# EasyEDA Pro project ProProject_FOC PRO_2025-05-28.epro, schematic Schematic1

## Sheets
1 P1: Create Date: 2024-11-13; Page Name: P1; Project Name: FOC PRO; Schematic Name: Schematic1; Update Date: 2024-12-27; Company: 嘉立创EDA; Page Size: A4; Version: V1.0
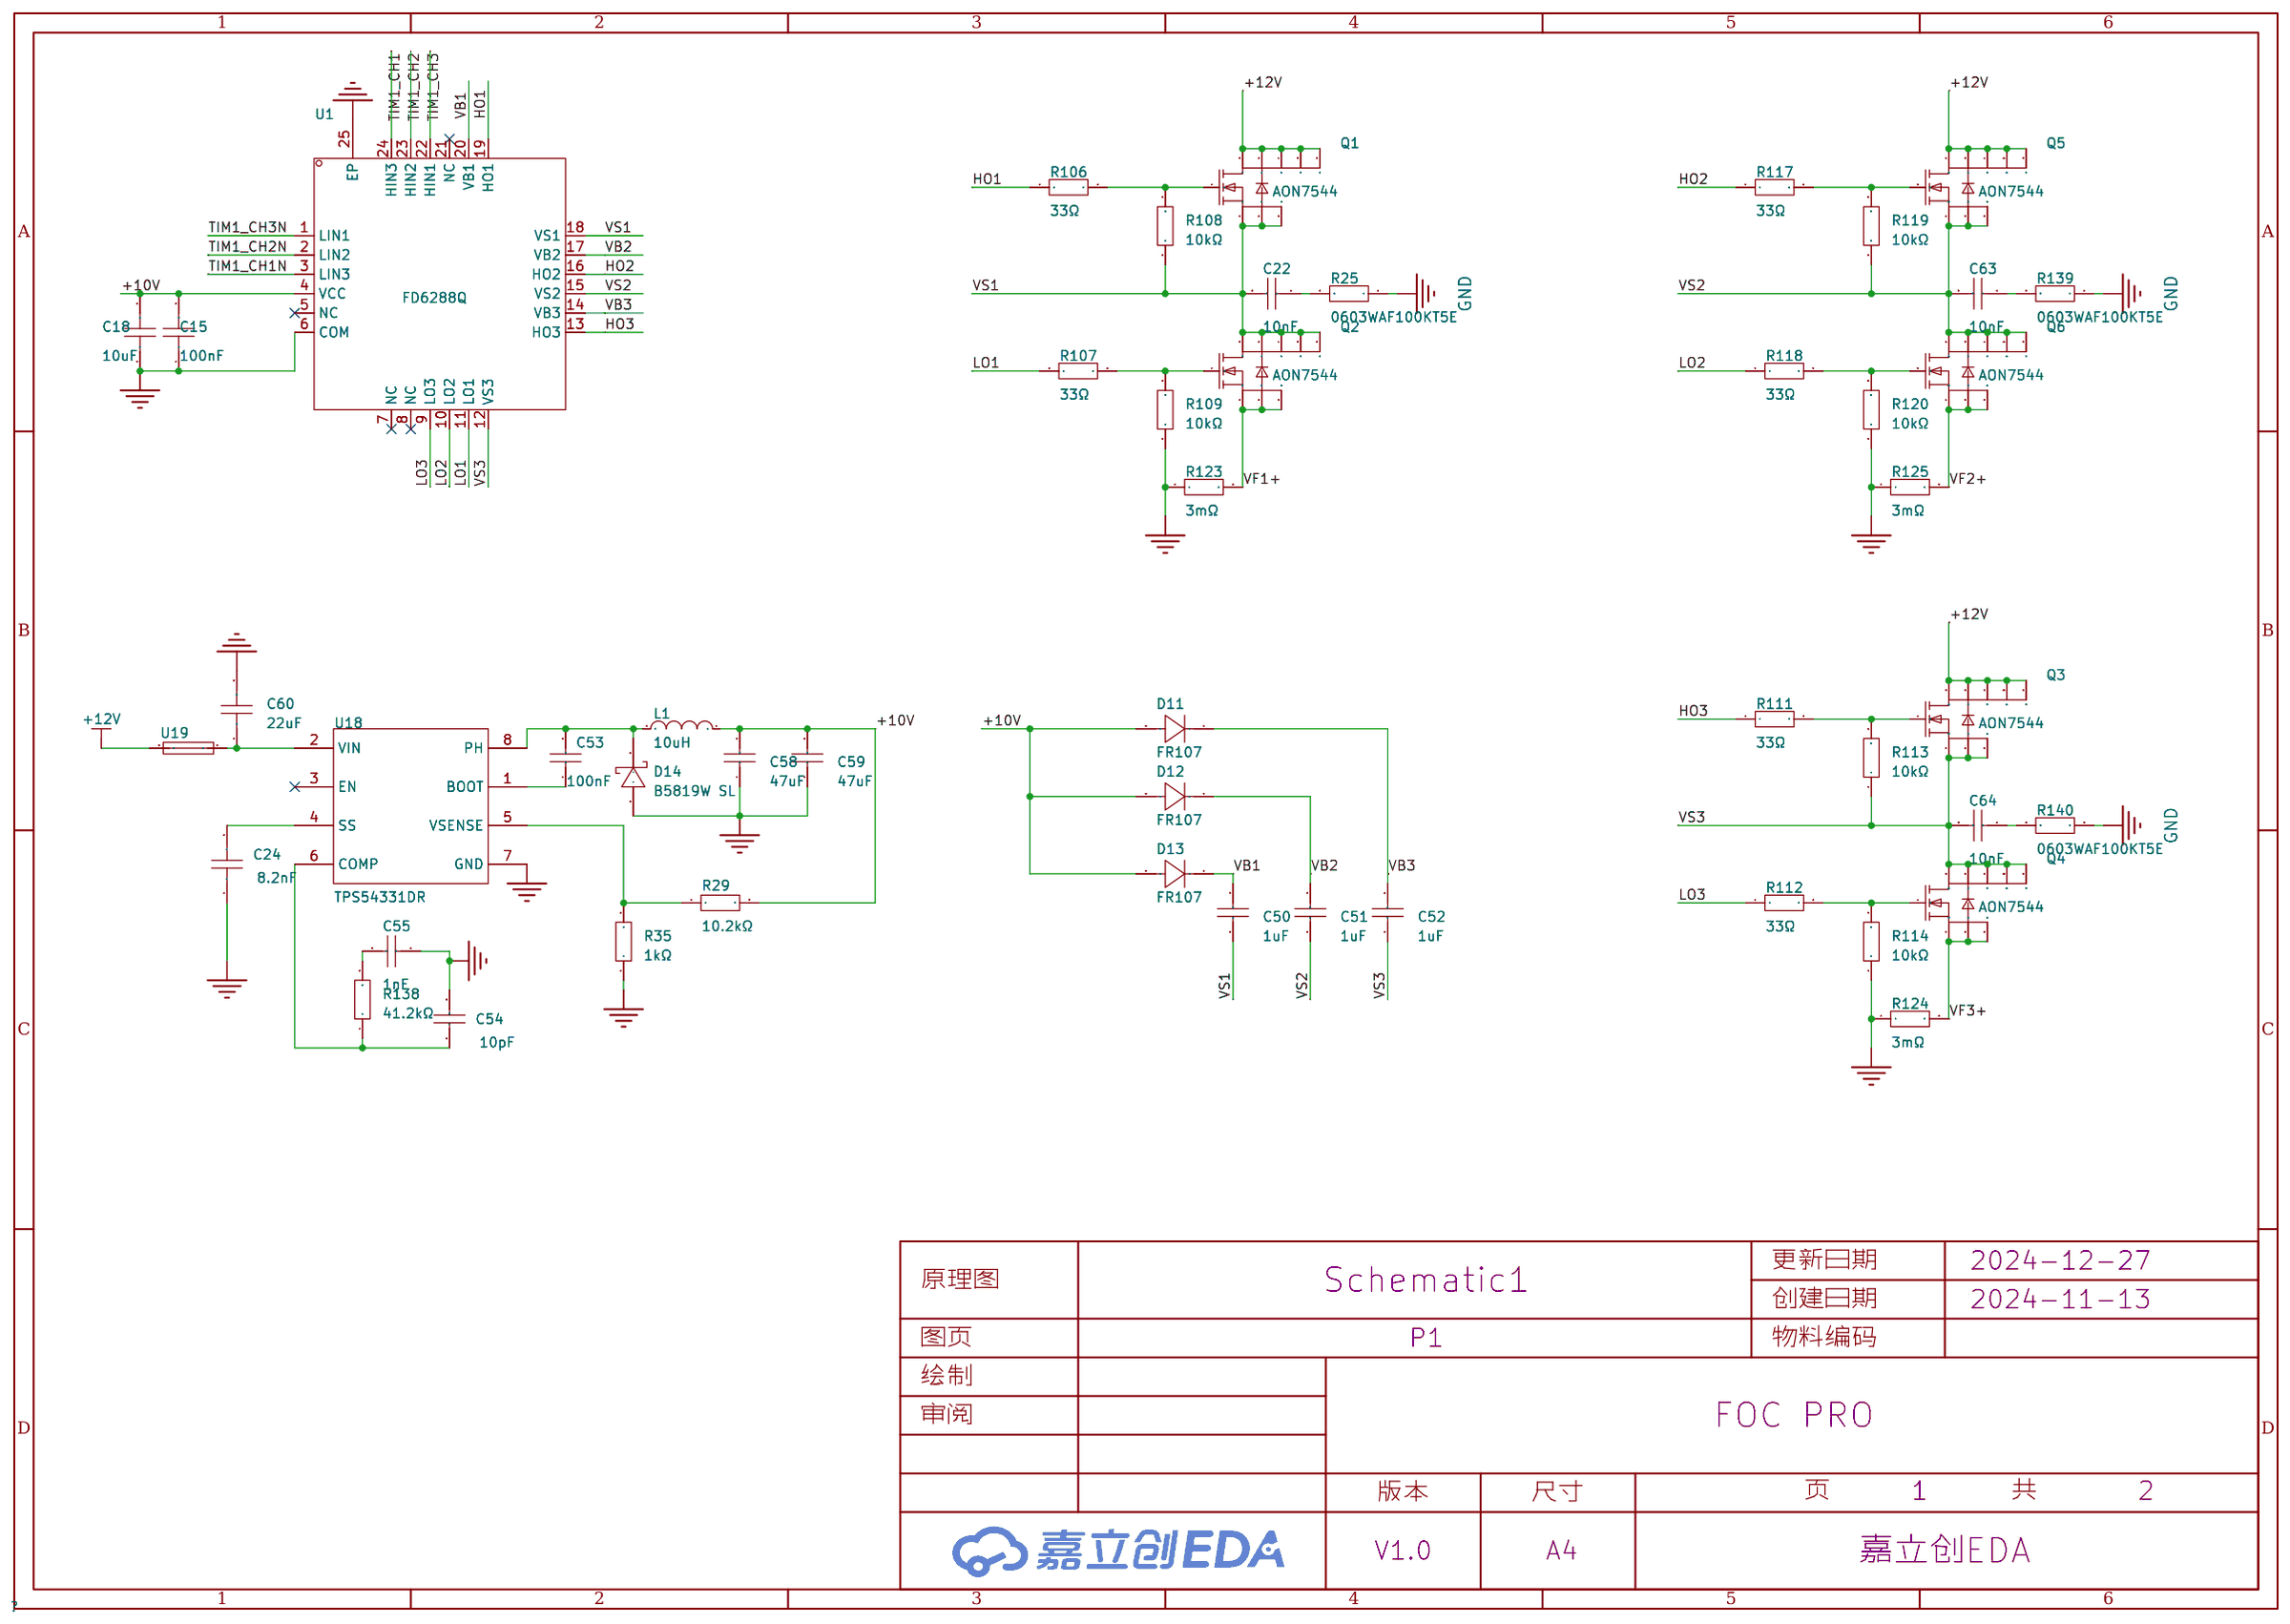
[diagram p0: P1]
2 P2: Page Name: P2
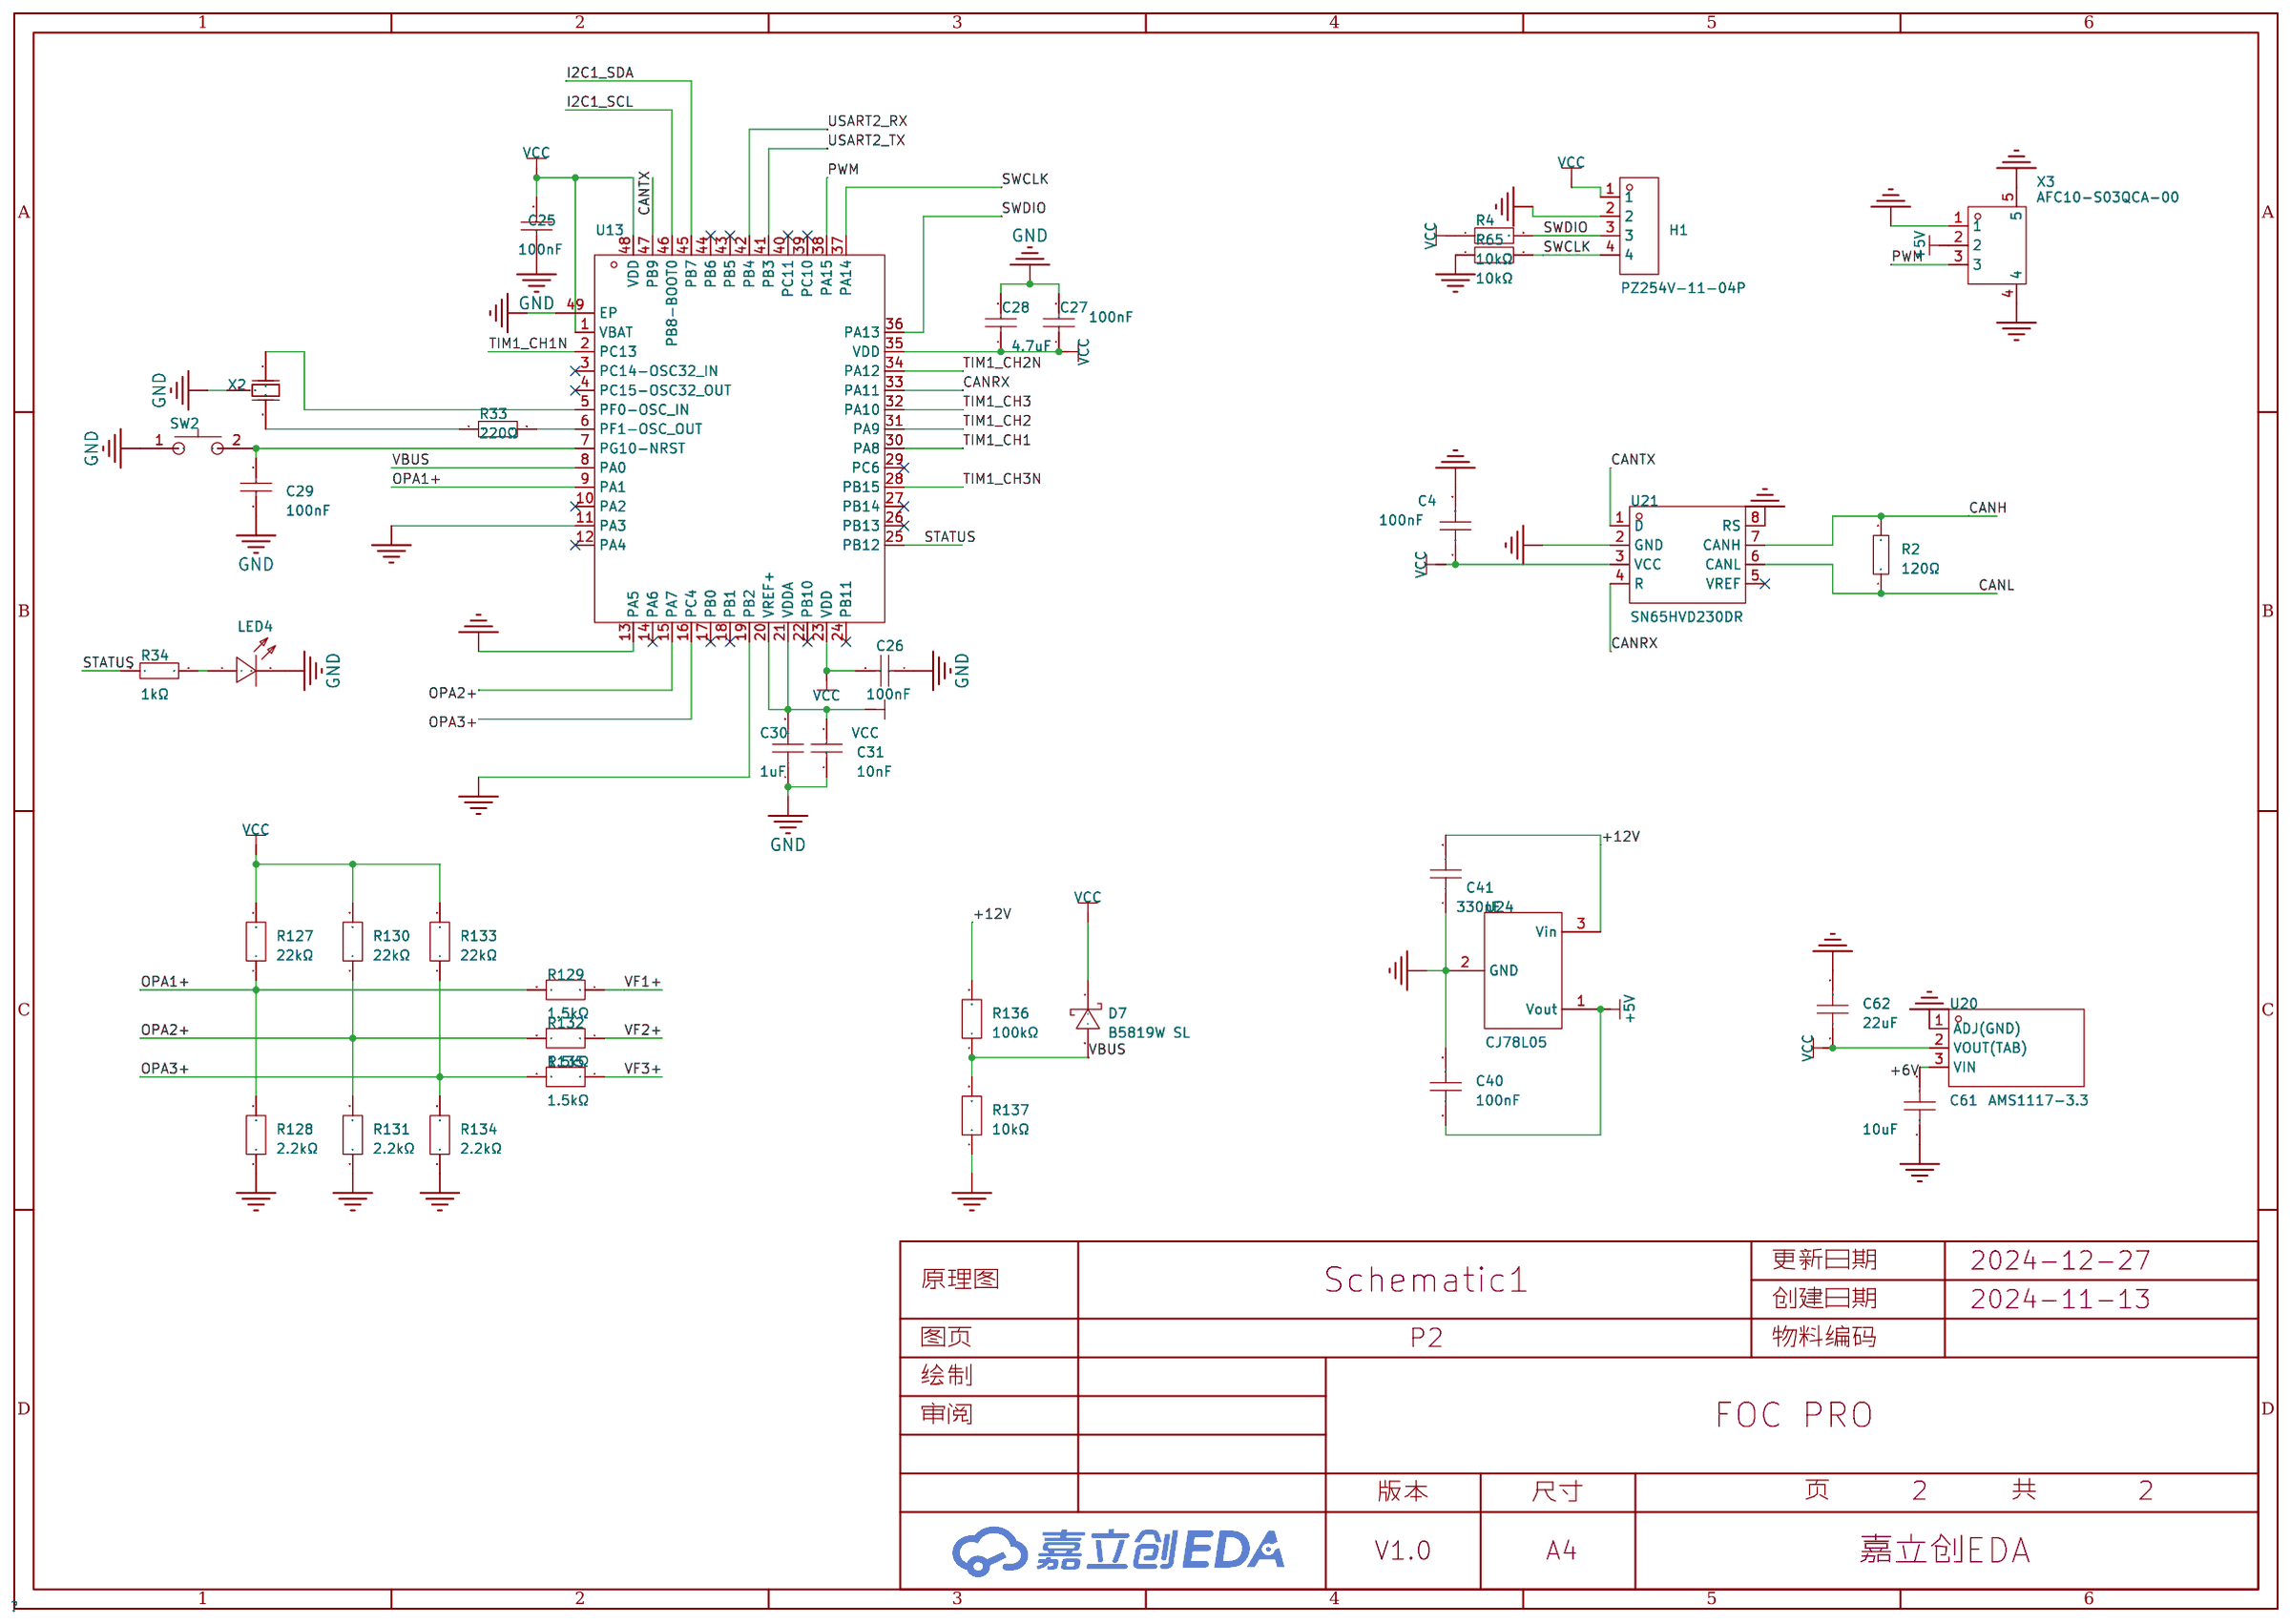
[diagram p1: P2]

## Parts
sheet P1
C15  100nF  [C0603]
C18  10uF  [C0603]
C22  10nF  [C0603]
C24  8.2nF  [C0603]
C50  1uF  [C0603]
C51  1uF  [C0603]
C52  1uF  [C0603]
C53  100nF  [C0603]
C54  10pF  [C0603]
C55  1nF  [C0603]
C58  47uF  [C0603]
C59  47uF  [C0603]
C60  22uF  [C0603]
C63  10nF  [C0603]
C64  10nF  [C0603]
D11  FR107  [SOD-123FL_L2.7-W1.8-LS3.8-RD]
D12  FR107  [SOD-123FL_L2.7-W1.8-LS3.8-RD]
D13  FR107  [SOD-123FL_L2.7-W1.8-LS3.8-RD]
D14  B5819W SL  [SOD-123_L2.7-W1.6-LS3.7-RD-1]
L1  10uH  [IND-SMD_L2.5-W2.0]
Q1  AON7544  [DFN-8_L3.2-W3.1-P0.65-LS3.4-BL]
Q2  AON7544  [DFN-8_L3.2-W3.1-P0.65-LS3.4-BL]
Q3  AON7544  [DFN-8_L3.2-W3.1-P0.65-LS3.4-BL]
Q4  AON7544  [DFN-8_L3.2-W3.1-P0.65-LS3.4-BL]
Q5  AON7544  [DFN-8_L3.2-W3.1-P0.65-LS3.4-BL]
Q6  AON7544  [DFN-8_L3.2-W3.1-P0.65-LS3.4-BL]
R25  0603WAF100KT5E  [r0603]
R29  10.2kΩ  [R0603]
R35  1kΩ  [R0603]
R106  33Ω  [R0402]
R107  33Ω  [R0402]
R108  10kΩ  [R0402]
R109  10kΩ  [R0402]
R111  33Ω  [R0402]
R112  33Ω  [R0402]
R113  10kΩ  [R0402]
R114  10kΩ  [R0402]
R117  33Ω  [R0402]
R118  33Ω  [R0402]
R119  10kΩ  [R0402]
R120  10kΩ  [R0402]
R123  3mΩ  [R1206]
R124  3mΩ  [R1206]
R125  3mΩ  [R1206]
R138  41.2kΩ  [R0402]
R139  0603WAF100KT5E  [r0603]
R140  0603WAF100KT5E  [r0603]
U1  FD6288Q  [QFN-24_L4.0-W4.0-P0.50-BL-EP2.6]
U18  TPS54331DR  [SOIC-8_L5.0-W4.0-P1.27-LS6.0-BL]
U19  1206L150/12SLYR  [R1206]
sheet P2
C4  100nF  [C0603]
C25  100nF  [c0402_new]
C26  100nF  [c0402_new]
C27  100nF  [c0402_new]
C28  4.7uF  [C0603]
C29  100nF  [c0402_new]
C30  1uF  [C0402]
C31  10nF  [C0402]
C40  100nF  [C0603]
C41  330nF  [C0603]
C61  10uF  [C0603]
C62  22uF  [C0603]
D7  B5819W SL  [SOD-123_L2.7-W1.6-LS3.7-RD-1]
H1  PZ254V-11-04P  [HDR-TH_4P-P2.54-V-M]
LED4  TLMG1100-GS08  [LED0603-R-RD_GREEN]
R2  120Ω  [R0603]
R4  10kΩ  [r0603]
R33  220Ω  [R0402]
R34  1kΩ  [R0402]
R65  10kΩ  [r0603]
R127  22kΩ  [R0603]
R128  2.2kΩ  [R0603]
R129  1.5kΩ  [R0603]
R130  22kΩ  [R0603]
R131  2.2kΩ  [R0603]
R132  1.5kΩ  [R0603]
R133  22kΩ  [R0603]
R134  2.2kΩ  [R0603]
R135  1.5kΩ  [R0603]
R136  100kΩ  [R0603]
R137  10kΩ  [R0603]
SW2  GT-TC029B-H025-L1N  [SW-SMD_L3.9-W3.0-P4.45]
U13  -  [UFQFPN-48_L7.0-W7.0-P0.50-BL-EP]
U20  AMS1117-3.3  [SOT-89_L4.5-W2.5-P1.50-LS4.2-BR]
U21  SN65HVD230DR  [SOIC-8_L4.9-W3.9-P1.27-LS6.0-BL]
U24  CJ78L05  [SOT-89-3_L4.5-W2.5-P1.50-LS4.2-BR]
X2  CSTNE8M00GH5C000R0  [OSC-SMD_3P-L3.2-W1.3-P1.20-L]
X3  AFC10-S03QCA-00  [CONN-SMD_AFC10-S03QCA-00]

## Library data of the parts
C15 = CC0603KRX7R9BB104: 容值:100nF;精度:±10%;额定电压:50V;材质(温度系数):X7R;; LCSC Part Name: 100nF ±10% 50V; Supplier Part: C14663; Manufacturer: YAGEO(国巨); Supplier Footprint: 0603; JLCPCB Part Class: Basic Part; Datasheet: https://atta.szlcsc.com/upload/public/pdf/source/20170116/1484561234239.pdf; Supplier: LCSC; Tolerance: ±10%; Voltage Rated: 50V; Temperature Coefficient: X7R
C18 = CL10A106KP8NNNC: 容值:10uF;精度:±10%;额定电压:10V;材质(温度系数):X5R;; LCSC Part Name: 10uF ±10% 10V; Supplier Part: C19702; Manufacturer: SAMSUNG(三星); Supplier Footprint: 0603; JLCPCB Part Class: Basic Part; Datasheet: https://atta.szlcsc.com/upload/public/pdf/source/20160103/1457707703378.pdf; Supplier: LCSC; Tolerance: ±10%; Voltage Rated: 10V; Temperature Coefficient: X5R
C22 C63 C64 = CC0603KRX7R9BB103: 容值:10nF;精度:±10%;额定电压:50V;材质(温度系数):X7R;; LCSC Part Name: 10nF ±10% 50V; Supplier Part: C100042; Manufacturer: YAGEO(国巨); Supplier Footprint: 0603; JLCPCB Part Class: Extended Part; Datasheet: https://atta.szlcsc.com/upload/public/pdf/source/20180326/C100042_E8B0111D51DE3671A0A4A59FBCEFE81C.pdf; Supplier: LCSC; Tolerance: ±10%; Voltage Rated: 50V; Temperature Coefficient: X7R
C24 = CC0603KRX7R9BB822: 容值:8.2nF;精度:±10%;额定电压:50V;材质(温度系数):X7R;; LCSC Part Name: 8.2nF ±10% 50V; Supplier Part: C113812; Manufacturer: YAGEO(国巨); Supplier Footprint: 0603; JLCPCB Part Class: Extended Part; Datasheet: https://atta.szlcsc.com/upload/public/pdf/source/20170602/1496384445452.pdf; Supplier: LCSC; Tolerance: ±10%; Voltage Rated: 50V; Temperature Coefficient: X7R
C50-C52 = CL10A105KB8NNNC: 容值:1uF;精度:±10%;额定电压:50V;材质(温度系数):X5R;; LCSC Part Name: 1uF ±10% 50V; Supplier Part: C15849; Manufacturer: SAMSUNG(三星); Supplier Footprint: 0603; JLCPCB Part Class: Basic Part; Datasheet: https://atta.szlcsc.com/upload/public/pdf/source/20160103/1457707679084.pdf; Supplier: LCSC; Tolerance: ±10%; Voltage Rated: 50V; Temperature Coefficient: X5R
C53 = CL10B104KB8NNNC: 容值:100nF;精度:±10%;额定电压:50V;材质(温度系数):X7R;; LCSC Part Name: 100nF ±10% 50V; Supplier Part: C1591; Manufacturer: SAMSUNG(三星); Supplier Footprint: 0603; JLCPCB Part Class: Extended Part; Datasheet: https://atta.szlcsc.com/upload/public/pdf/source/20160103/1457707680512.pdf; Supplier: LCSC; Tolerance: ±10%; Voltage Rated: 50V; Temperature Coefficient: X7R
C54 = CC0603JRNPO9BN100: 容值:10pF;精度:±5%;额定电压:50V;材质(温度系数):NP0;; LCSC Part Name: 10pF ±5% 50V; Supplier Part: C106245; Manufacturer: YAGEO(国巨); Supplier Footprint: 0603; JLCPCB Part Class: Extended Part; Datasheet: https://atta.szlcsc.com/upload/public/pdf/source/20170505/1493957837406.pdf; Supplier: LCSC; Tolerance: ±5%; Voltage Rated: 50V; Temperature Coefficient: NP0
C55 = CC0603KRX7R9BB102: 容值:1nF;精度:±10%;额定电压:50V;材质(温度系数):X7R;; LCSC Part Name: 1nF ±10% 50V; Supplier Part: C100040; Manufacturer: YAGEO(国巨); Supplier Footprint: 0603; JLCPCB Part Class: Extended Part; Datasheet: https://atta.szlcsc.com/upload/public/pdf/source/20170420/1492670664651.pdf; Supplier: LCSC; Tolerance: ±10%; Voltage Rated: 50V; Temperature Coefficient: X7R
C58 C59 = GRM188R60J476ME15D: 容值:47uF;精度:±20%;额定电压:6.3V;材质(温度系数):X5R;; LCSC Part Name: 47uF ±20% 6.3V; Supplier Part: C140782; Manufacturer: muRata(村田); Supplier Footprint: 0603; JLCPCB Part Class: 扩展库; Datasheet: https://atta.szlcsc.com/upload/public/pdf/source/20171113/C140782_15105612981581115778.pdf; Supplier: LCSC; Tolerance: ±20%; Voltage Rated: 6.3V; Temperature Coefficient: X5R
C60 C62 = CGA0603X5R226M160JT: 容值:22uF;精度:±20%;额定电压:16V;材质(温度系数):X5R;; LCSC Part Name: 22uF ±20% 16V; Supplier Part: C6119868; Manufacturer: HRE(芯声); Supplier Footprint: 0603; JLCPCB Part Class: 扩展库; Supplier: LCSC; Tolerance: ±20%; Voltage Rated: 16V; Temperature Coefficient: X5R
D11-D13 = FR107_C2760867: 二极管配置:独立式;正向压降(Vf):1.3V@1A;直流反向耐压(Vr):1kV;平均整流电流(Io):1A;反向恢复时间(trr):500ns;; LCSC Part Name: 电压:1kV 电流:1A; Supplier Part: C2760867; Manufacturer: Slkor(萨科微); Supplier Footprint: SOD-123FL; JLCPCB Part Class: 扩展库; Datasheet: https://atta.szlcsc.com/upload/public/pdf/source/20210316/C2760867_0B45AFF5F62837EEEC945A80EBBE02AA.pdf; Supplier: LCSC; Diode Configuration: 独立式; Forward Voltage (Vf@If): 1.3V@1A; Reverse Voltage (Vr): 1kV; Average Rectified Current (Io): 1A; Reverse Leakage Current: 5uA@1kV; Reverse Recovery Time (trr): 500ns; Operating Temperature: -55℃~+150℃@(Tj)
D7 D14 = B5819W SL: 正向压降(Vf):600mV@1A;直流反向耐压(Vr):40V;整流电流:1A;; LCSC Part Name: 电压:40V 电流:1A; Supplier Part: C8598; Manufacturer: CJ(江苏长电/长晶); Supplier Footprint: SOD-123; JLCPCB Part Class: 基础库; Datasheet: https://atta.szlcsc.com/upload/public/pdf/source/20171228/C164911_15144413243851213914.pdf; Supplier: LCSC; Forward Voltage (Vf@If): 600mV@1A; Reverse Voltage (Vr): 40V; Rectified Current: 1A
L1 = FTC252012S100MBCA: 电感值:10uH;精度:±20%;额定电流:1.2A;饱和电流(Isat):1.6A;类型:一体成型电感;; LCSC Part Name: 10uH ±20% 1.6A; Supplier Part: C5832376; Manufacturer: cjiang(长江微电); Supplier Footprint: SMD,2x2.5mm; JLCPCB Part Class: 扩展库; Datasheet: https://atta.szlcsc.com/upload/public/pdf/source/20230602/8FFEDA9C0247A92A0D4B67554BFE4091.pdf; Supplier: LCSC; Tolerance: ±20%; Rated Current: 1.2A; Saturation Current (Isat): 1.6A; DC Resistance (DCR): 330mΩ; Type: 一体成型电感
Q1-Q6 = AON7544_C5261066: 类型:1个N沟道;漏源电压(Vdss):30V;连续漏极电流(Id):100A;功率(Pd):62.5W;导通电阻(RDS(on)@Vgs,Id):4mΩ@10V;阈值电压(Vgs(th)@Id):2.5V@250uA;; LCSC Part Name: 1个N沟道 耐压:30V 电流:100A; Supplier Part: C5261066; Manufacturer: HXY MOSFET(华轩阳电子); Supplier Footprint: DFN-8L(3x3); JLCPCB Part Class: 扩展库; Datasheet: https://atta.szlcsc.com/upload/public/pdf/source/20221216/DA9BC77C8F7E8FAEBCF36803CD6A143F.pdf; Supplier: LCSC; Type: 1个N沟道; Drain Source Voltage (Vdss): 30V; Continuous Drain Current (Id): 100A; Power Dissipation (Pd): 62.5W; Drain Source On Resistance (RDS(on)@Vgs,Id): 4mΩ@10V; Gate Threshold Voltage (Vgs(th)@Id): 2.5V@250uA; Input Capacitance (Ciss@Vds): 3.075nF
R25 R139 R140 = 0603WAF100KT5E: LCSC Part Name: 1Ω(1R00) ±1% 编带; Supplier Part: C22936; Manufacturer: UNI-ROYAL(厚声); Supplier Footprint: 0603; JLCPCB Part Class: Basic Part; Datasheet: https://atta.szlcsc.com/upload/public/pdf/source/20170920/C22936_1505900993356982325.pdf; Supplier: LCSC
R29 = 0603WAF1022T5E: 电阻类型:厚膜电阻;阻值:10.2kΩ;精度:±1%;功率:100mW;温度系数:±100ppm/℃;最大工作电压:75V;工作温度范围:-55℃~+155℃;; LCSC Part Name: 10.2kΩ ±1% 100mW; Supplier Part: C22772; Manufacturer: UNI-ROYAL(厚声); Supplier Footprint: 0603; JLCPCB Part Class: Extended Part; Datasheet: https://atta.szlcsc.com/upload/public/pdf/source/20200306/C422600_1E6D84923E4A46A82E41ADD87F860B5C.pdf; Supplier: LCSC; Type: 厚膜电阻; Tolerance: ±1%; Power(Watts): 100mW; Temperature Coefficient: ±100ppm/℃; Overload Voltage (Max): 75V; Operating Temperature Range: -55℃~+155℃
R35 = 0603WAF2001T5E: 电阻类型:厚膜电阻;阻值:2kΩ;精度:±1%;功率:100mW;; LCSC Part Name: 2kΩ ±1% 100mW; Supplier Part: C22975; Manufacturer: UNI-ROYAL(厚声); Supplier Footprint: 0603; JLCPCB Part Class: Basic Part; Datasheet: https://atta.szlcsc.com/upload/public/pdf/source/20200306/C422600_1E6D84923E4A46A82E41ADD87F860B5C.pdf; Supplier: LCSC; Type: 厚膜电阻; Tolerance: ±1%; Power(Watts): 100mW; Temperature Coefficient: ±100ppm/℃; Overload Voltage (Max): 75V; Operating Temperature Range: -55℃~+155℃
R106 R107 R111 R112 R117 R118 = 0402WGF330JTCE: 电阻类型:厚膜电阻;阻值:33Ω;精度:±1%;功率:62.5mW;最大工作电压:50V;温度系数:±100ppm/℃;; LCSC Part Name: 33Ω ±1% 62.5mW 厚膜电阻; Supplier Part: C25105; Manufacturer: UNI-ROYAL(厚声); Supplier Footprint: 0402; JLCPCB Part Class: 基础库; Datasheet: https://atta.szlcsc.com/upload/public/pdf/source/20200306/C422600_1E6D84923E4A46A82E41ADD87F860B5C.pdf; Supplier: LCSC; Type: 厚膜电阻; Tolerance: ±1%; Power(Watts): 62.5mW; Overload Voltage (Max): 50V; Temperature Coefficient: ±100ppm/℃; Operating Temperature Range: -55℃~+155℃
R108 R109 R113 R114 R119 R120 = 0402WGF1002TCE: 电阻类型:厚膜电阻;阻值:10kΩ;精度:±1%;功率:62.5mW;最大工作电压:50V;温度系数:±100ppm/℃;; LCSC Part Name: 10kΩ ±1% 62.5mW 厚膜电阻; Supplier Part: C25744; Manufacturer: UNI-ROYAL(厚声); Supplier Footprint: 0402; JLCPCB Part Class: 基础库; Datasheet: https://atta.szlcsc.com/upload/public/pdf/source/20200306/C422600_1E6D84923E4A46A82E41ADD87F860B5C.pdf; Supplier: LCSC; Type: 厚膜电阻; Tolerance: ±1%; Power(Watts): 62.5mW; Overload Voltage (Max): 50V; Temperature Coefficient: ±100ppm/℃; Operating Temperature Range: -55℃~+155℃
R123-R125 = 1206W4F100LT5E: 电阻类型:厚膜电阻;阻值:100mΩ;精度:±1%;功率:250mW;最大工作电压:200V;温度系数:±800ppm/℃;; LCSC Part Name: 100mΩ ±1% 250mW 厚膜电阻; Supplier Part: C25334; Manufacturer: UNI-ROYAL(厚声); Supplier Footprint: 1206; JLCPCB Part Class: 基础库; Datasheet: https://atta.szlcsc.com/upload/public/pdf/source/20200306/C422600_1E6D84923E4A46A82E41ADD87F860B5C.pdf; Supplier: LCSC; Type: 厚膜电阻; Tolerance: ±1%; Power(Watts): 250mW; Overload Voltage (Max): 200V; Temperature Coefficient: ±800ppm/℃; Operating Temperature Range: -55℃~+155℃
R138 = RC0402FR-0759KL: 电阻类型:厚膜电阻;阻值:59kΩ;精度:±1%;功率:62.5mW;; LCSC Part Name: 厚膜电阻 59kΩ ±1% 62.5mW; Supplier Part: C163459; Manufacturer: YAGEO(国巨); Supplier Footprint: 0402; JLCPCB Part Class: Extended Part; Datasheet: https://atta.szlcsc.com/upload/public/pdf/source/20180111/C163459_15156544510361258980.pdf; Supplier: LCSC; Type: 厚膜电阻; Tolerance: ±1%; Power(Watts): 62.5mW; Temperature Coefficient: ±100ppm/℃; Overload Voltage (Max): 50V; Operating Temperature Range: -55℃~+155℃
U1 = FD6288Q: Supplier Part: C328453; Manufacturer: Fortior Tech(峰岹); Supplier Footprint: QFN-24-EP(4x4); JLCPCB Part Class: 扩展库; Datasheet: https://atta.szlcsc.com/upload/public/pdf/source/20181108/C328453_785547738DB9FC0123219FC22539EFAD.pdf; Supplier: LCSC
U18 = TPS54331DR: 功能类型:降压型;同步整流:-;输出通道数:-;拓扑结构:-;输入电压:-;输出电流(最大值):-;开关频率:-;; LCSC Part Name: 降压型; Supplier Part: C9865; Manufacturer: TI(德州仪器); Supplier Footprint: SOIC-8-150mil; JLCPCB Part Class: Basic Part; Datasheet: https://atta.szlcsc.com/upload/public/pdf/source/20121112/1457706556448.pdf; Supplier: LCSC; Function: 降压型
U19 = 1206L150/12SLYR: 最大电压:12V;最大电流:50A;保持电流:1.5A;跳闸电流:3A;; LCSC Part Name: 12V 1.5A 1206自恢复; Supplier Part: C315895; Manufacturer: Littelfuse(美国力特); Supplier Footprint: 1206; JLCPCB Part Class: Extended Part; Datasheet: https://atta.szlcsc.com/upload/public/pdf/source/20181031/C315895_C044A45A98A30E357FA40B8FB61F45D5.pdf; Supplier: LCSC; Operating Voltage (Max): 12V; Current Rating (Max): 50A; Hold Current: 1.5A; Trip Current: 3A; Resistance - Initial (Ri) (Min): 80mΩ; Resistance - Post Trip (R1) (Max): 10mΩ; Maximum Time to Trip: 300ms; Operating Temperature: -40℃~+85℃
C4 = CGA0603X7R104K500JT: 容值:100nF;精度:±10%;额定电压:50V;材质(温度系数):X7R;; LCSC Part Name: 100nF ±10% 50V; Supplier Part: C6119867; Manufacturer: HRE(芯声); Supplier Footprint: 0603; JLCPCB Part Class: 扩展库; Supplier: LCSC; Tolerance: ±10%; Voltage Rated: 50V; Temperature Coefficient: X7R
C25-C27 C29 = CL05B104KO5NNNC: 容值:100nF;精度:±10%;额定电压:16V;材质(温度系数):X7R;; LCSC Part Name: 100nF±10%16V; Supplier Part: C1525; Manufacturer: SAMSUNG(三星); Supplier Footprint: 0402; JLCPCB Part Class: BasicPart; Datasheet: https://atta.szlcsc.com/upload/public/pdf/source/20160103/1457707674891.pdf; Supplier: LCSC; Tolerance: ±10%; Voltage Rated: 16V; Temperature Coefficient: X7R
C28 = CL10A475KO8NNNC: 容值:4.7uF;精度:±10%;额定电压:16V;材质(温度系数):X5R;; LCSC Part Name: 4.7uF±10%16V; Supplier Part: C19666; Manufacturer: SAMSUNG(三星); Supplier Footprint: 0603; JLCPCB Part Class: BasicPart; Datasheet: https://atta.szlcsc.com/upload/public/pdf/source/20160103/1457707703134.pdf; Supplier: LCSC; Tolerance: ±10%; Voltage Rated: 16V; Temperature Coefficient: X5R
C30 = CL05A105KA5NQNC: 容值:1uF;精度:±10%;额定电压:25V;材质(温度系数):X5R;; LCSC Part Name: 1uF±10%25V; Supplier Part: C52923; Manufacturer: SAMSUNG(三星); Supplier Footprint: 0402; JLCPCB Part Class: BasicPart; Datasheet: https://atta.szlcsc.com/upload/public/pdf/source/20160103/1457707735223.pdf; Supplier: LCSC; Tolerance: ±10%; Voltage Rated: 25V; Temperature Coefficient: X5R
C31 = CL05B103KB5NNNC: 容值:10nF;精度:±10%;额定电压:50V;材质(温度系数):X7R;; LCSC Part Name: 10nF±10%50V; Supplier Part: C15195; Manufacturer: SAMSUNG(三星); Supplier Footprint: 0402; JLCPCB Part Class: BasicPart; Datasheet: https://atta.szlcsc.com/upload/public/pdf/source/20160103/1457707674468.pdf; Supplier: LCSC; Tolerance: ±10%; Voltage Rated: 50V; Temperature Coefficient: X7R
C40 = CC0603KRX7R9BB104: 容值:100nF;精度:±10%;额定电压:50V;材质(温度系数):X7R;; LCSC Part Name: 100nF ±10% 50V; Supplier Part: C14663; Manufacturer: YAGEO(国巨); Supplier Footprint: 0603; JLCPCB Part Class: Basic Part; Datasheet: https://atta.szlcsc.com/upload/public/pdf/source/20180910/C282072_33301C7F631E79921B82A8DAC6BCC5B3.pdf; Supplier: LCSC; Tolerance: ±10%; Voltage Rated: 50V; Temperature Coefficient: X7R
C41 = TCC0603X7R334K500CT: 容值:330nF;精度:±10%;额定电压:50V;材质(温度系数):X7R;; LCSC Part Name: 330nF ±10% 50V; Supplier Part: C282682; Manufacturer: CCTC(三环); Supplier Footprint: 0603; JLCPCB Part Class: Extended Part; Datasheet: https://atta.szlcsc.com/upload/public/pdf/source/20180917/C282682_1718F679992BEDE33060A0CDFA427AE7.pdf; Supplier: LCSC; Tolerance: ±10%; Voltage Rated: 50V; Temperature Coefficient: X7R
C61 = HGC0603R5106M160NTHJ: 容值:10uF;精度:±20%;额定电压:16V;材质(温度系数):X5R;; LCSC Part Name: 10uF ±20% 16V; Supplier Part: C7472959; Manufacturer: Chinocera(华瓷); Supplier Footprint: 0603; JLCPCB Part Class: 扩展库; Datasheet: https://atta.szlcsc.com/upload/public/pdf/source/20240320/FAC3FEC40A78BC5CCCE96C232A94D860.pdf; Supplier: LCSC; Tolerance: ±20%; Voltage Rated: 16V; Temperature Coefficient: X5R
H1 = PZ254V-11-04P: 插针结构:1x4P;间距:2.54mm;行距:-;圆针/方针:方针;安装类型:直插;排数:单排;总PIN位数:4P;额定电流:3A;额定电压:250V;配合针长度:6mm;塑高:2.5mm;端接针长度:3mm;触头材质:-;工作温度范围:-40℃~+105℃;颜色:黑色;; LCSC Part Name: 间距:2.54mm 1x4P 直插 方针; Supplier Part: C2691448; Manufacturer: XFCN(兴飞); Supplier Footprint: 插件,P=2.54mm; JLCPCB Part Class: 扩展库; Datasheet: https://atta.szlcsc.com/upload/public/pdf/source/20200309/C492403_F9F19131791D08044AD4F84F8E751A34.pdf; Supplier: LCSC; Pin Structure: 1x4P; Pitch: 2.54mm; Circluar Pins/Square Pins: 方针; Mounting Type: 直插; Number of Rows: 单排; Number of Pins: 4P; Current Rating (Max): 3A; Voltage Rating (Max): 250V; Length of Mating Pin: 6mm; Insulation Height: 2.5mm; Length of End Connection Pin: 3mm; Operating Temperature Range: -40℃~+105℃; Color: 黑色
LED4 = TLMG1100-GS08: 照明颜色:普绿/黄绿;色温-CCT（K）:-;主波长/色坐标:570nm;; LCSC Part Name: 普绿/黄绿0603; Supplier Part: C241891; Manufacturer: VISHAY(威世); Supplier Footprint: 0603; JLCPCB Part Class: ExtendedPart; Datasheet: https://atta.szlcsc.com/upload/public/pdf/source/20180719/C241891_3C76D4DD30CDE57601F75DEAAAECA69D.pdf; Supplier: LCSC; Mounting Type: 表面贴装; Illumination Color: 普绿/黄绿; Luminous Intensity (IF=20mA): 35mcd; Dominant Wavelength / Coordinate rank: 570nm
R2 = 0603WAF1200T5E: 电阻类型:厚膜电阻;阻值:120Ω;精度:±1%;功率:100mW;最大工作电压:75V;温度系数:±100ppm/℃;; LCSC Part Name: 120Ω ±1% 100mW 厚膜电阻; Supplier Part: C22787; Manufacturer: UNI-ROYAL(厚声); Supplier Footprint: 0603; JLCPCB Part Class: 基础库; Datasheet: https://atta.szlcsc.com/upload/public/pdf/source/20200306/C422600_1E6D84923E4A46A82E41ADD87F860B5C.pdf; Supplier: LCSC; Type: 厚膜电阻; Tolerance: ±1%; Power(Watts): 100mW; Overload Voltage (Max): 75V; Temperature Coefficient: ±100ppm/℃; Operating Temperature Range: -55℃~+155℃
R4 R65 = 0603WAF1002T5E: 电阻类型:厚膜电阻;阻值:10kΩ;精度:±1%;功率:100mW;温度系数:±100ppm/℃;最大工作电压:75V;工作温度范围:-55℃~+155℃;; LCSC Part Name: 10kΩ ±1% 100mW; Supplier Part: C25804; Manufacturer: UNI-ROYAL(厚声); Supplier Footprint: 0603; JLCPCB Part Class: Basic Part; Datasheet: https://atta.szlcsc.com/upload/public/pdf/source/20200306/C422600_1E6D84923E4A46A82E41ADD87F860B5C.pdf; Supplier: LCSC; Type: 厚膜电阻; Tolerance: ±1%; Power(Watts): 100mW; Temperature Coefficient: ±100ppm/℃; Overload Voltage (Max): 75V; Operating Temperature Range: -55℃~+155℃
R33 = RC0402FR-07220RL: 电阻类型:厚膜电阻;阻值:220Ω;精度:±1%;功率:62.5mW;温度系数:±100ppm/℃;最大工作电压:50V;工作温度范围:-55℃~+155℃;; LCSC Part Name: 220Ω±1%62.5mW; Supplier Part: C112291; Manufacturer: YAGEO(国巨); Supplier Footprint: 0402; JLCPCB Part Class: ExtendedPart; Datasheet: https://atta.szlcsc.com/upload/public/pdf/source/20170912/C112291_1505207744926963373.pdf; Supplier: LCSC; Type: 厚膜电阻; Tolerance: ±1%; Power(Watts): 62.5mW; Temperature Coefficient: ±100ppm/℃; Overload Voltage (Max): 50V; Operating Temperature Range: -55℃~+155℃
R34 = 0402WGF1001TCE: 电阻类型:厚膜电阻;阻值:1kΩ;精度:±1%;功率:62.5mW;; LCSC Part Name: 1kΩ±1%62.5mW; Supplier Part: C11702; Manufacturer: UNI-ROYAL(厚声); Supplier Footprint: 0402; JLCPCB Part Class: BasicPart; Datasheet: https://atta.szlcsc.com/upload/public/pdf/source/20200306/C422600_1E6D84923E4A46A82E41ADD87F860B5C.pdf; Supplier: LCSC; Type: 厚膜电阻; Tolerance: ±1%; Power(Watts): 62.5mW; Temperature Coefficient: ±100ppm/℃; Overload Voltage (Max): 50V; Operating Temperature Range: -55℃~+155℃
R127-R137 = FRC0603J103TS: 电阻类型:厚膜电阻;阻值:10kΩ;精度:±5%;功率:100mW;最大工作电压:75V;温度系数:±100ppm/℃;; LCSC Part Name: 10kΩ ±5% 100mW 厚膜电阻; Supplier Part: C2930027; Manufacturer: FOJAN(富捷); Supplier Footprint: 0603; JLCPCB Part Class: 扩展库; Datasheet: https://atta.szlcsc.com/upload/public/pdf/source/20211221/925EC7D7225764EE0046F22065062C87.pdf; Supplier: LCSC; Type: 厚膜电阻; Tolerance: ±5%; Power(Watts): 100mW; Overload Voltage (Max): 75V; Temperature Coefficient: ±100ppm/℃; Operating Temperature Range: -55℃~+155℃
SW2 = GT-TC029B-H025-L1N: 触点电流:50mA;额定电压(DC):12V;绝缘电阻:100MΩ;电路结构:单刀单掷;安装方式:立贴;按钮形状:圆形按钮;按钮/盖帽颜色:黑色;带灯:无;作用力:250gf@±30gf;机械寿命:100000;工作温度:-30℃~+85℃;引脚样式:SMD接片;开关长度:3.9mm;开关宽度:2.9mm;开关高度:2.5mm;带支架:否;; LCSC Part Name: 立式两脚小龟H2.5 250gf 无柱; Supplier Part: C843669; Manufacturer: G-Switch(品赞); Supplier Footprint: SMD,3×4×2.5mm; JLCPCB Part Class: Extended Part; Datasheet: https://atta.szlcsc.com/upload/public/pdf/source/20201014/C843665_B07D254A2E90B746498E934B945CCD5F.pdf; Supplier: LCSC; Contact Current: 50mA; Voltage Rating (DC): 12V; Insulation Resistance: 100MΩ; Circuit: 单刀单掷; Mounting Style: 立贴; Actuator Style: 圆形按钮; Actuator/Cap Color: 黑色; With Lamp: 无; Operating Force: 250gf@±30gf; Mechanical Life: 100000; Operating Temperature: -30℃~+85℃; Pin Style: SMD接片; Switch Length: 3.9mm; Switch Width: 2.9mm; Switch Height: 2.5mm; Strike Gundam: 否
U13 = STM32G431CBU6: CPU内核:ARMCortex-M4;CPU最大主频:170MHz;工作电压范围:1.71V~3.6V;内部振荡器:有;程序FLASH容量:128K@x8bit;RAM总容量:32KB;EEPROM/数据FLASH容量:-;GPIO端口数量:42;ADC(单元数/通道数/位数):1@x18ch/12bit;DAC(单元数/通道数/位数):1@x4ch/12bit;外设/功能/协议栈:欠压检测/复位；DMA；看门狗；POR；PWM;工作温度范围:-40℃~+85℃;; LCSC Part Name: ARMCortex-M4170MHz闪存：128K@x8bitRAM：32KB; Supplier Part: C529356; Manufacturer: ST(意法半导体); Supplier Footprint: UFQFPN-48; JLCPCB Part Class: ExtendedPart; Datasheet: https://atta.szlcsc.com/upload/public/pdf/source/20200511/C529354_7C66CF00837B904D0C15DCE45B69418C.pdf; Supplier: LCSC; CPU Core: ARMCortex-M4; Program Storage Size: 128KB; RAM Size: 32KB; GPIO Ports Number: 42; Operating Voltage Range: 1.71V~3.6V; CPU Maximum Speed: 170MHz; Program Memory Type: FLASH; Operating Temperature Range: -40℃~+85℃; ADC (Bit): 12bit; DAC (Bit): 12bit; Peripheral/Function: DMA；PWM; Watchdog: 有; Infrared Data Association: 有; Low-Voltage Detect: 有; Direct Memory Access: 有; Internal Oscillator: 有; Maximum Frequency: 170MHz; Supply Voltage Range: 1.71V~3.6V; Program FLASH Size: 128K@x8bit; ADC (Units/Channels/bits): 1@x18ch/12bit; DAC (Units/Channels/bits): 1@x4ch/12bit; Peripherals / Functions / Protocol Stacks: 欠压检测/复位；DMA；看门狗；POR；PWM
U20 = AMS1117-3.3_C347256: 输出类型:固定;工作电压:18V;输出电压:3.3V;输出电流:1A;电源纹波抑制比(PSRR):60dB@(120Hz);输出极性:正极;; LCSC Part Name: 输出:3.3V 电流:1A 耐压:12V; Supplier Part: C347256; Manufacturer: UMW(友台半导体); Supplier Footprint: SOT-89; JLCPCB Part Class: 扩展库; Datasheet: https://atta.szlcsc.com/upload/public/pdf/source/20241218/BAF0263FA2E44BCD8AF41AA4FA04EFAA.pdf; Supplier: LCSC; Output Type: 固定; Maximum Input Voltage: 18V; Output Voltage: 3.3V; Output Current: 1A; Power Supply Rejection Ratio (PSRR): 60dB@(120Hz); Dropout Voltage: 1.3V@(1A); Feature: 过流保护(OCP); Output Polarity: 正极; Number of Outputs: 1
U21 = SN65HVD230DR: 类型:CAN收发器;数据速率:1Mbps;; LCSC Part Name: 3.3-V CAN 收发器; Supplier Part: C12084; Manufacturer: TI(德州仪器); Supplier Footprint: SOIC-8; JLCPCB Part Class: 扩展库; Datasheet: https://www.ti.com/cn/lit/gpn/sn65hvd230; Supplier: LCSC; Type: CAN收发器; Data Rate: 1Mbps; Operating Temperature: -40℃~+85℃
U24 = CJ78L05_C2079: 输出类型:固定;输出极性:正;输出通道数:1;最大输入电压:30V;输出电压:5V;压差:1.7V@(40mA);输出电流:100mA;; LCSC Part Name: 正 Vin=30V Vout=5V 100mA; Supplier Part: C2079; Manufacturer: CJ(江苏长电/长晶); Supplier Footprint: SOT-89-3L; JLCPCB Part Class: Extended Part; Datasheet: https://atta.szlcsc.com/upload/public/pdf/source/20171013/C2079_15078985046641032894.pdf; Supplier: LCSC; Output Type: 固定; Output Polarity: 正; Number of Outputs: 1; Maximum Input Voltage: 30V; Output Voltage: 5V; Dropout Voltage: 1.7V@(40mA); Output Current: 100mA
X2 = CSTNE8M00GH5C000R0: LCSC Part Name: 8MHz±0.07%33pF; Supplier Part: C341525; Manufacturer: muRata(村田); Supplier Footprint: SMD; JLCPCB Part Class: ExtendedPart; Datasheet: https://atta.szlcsc.com/upload/public/pdf/source/20181211/C341525_832BA077079E4863A5153C1DB98581D5.pdf; Supplier: LCSC
X3 = AFC10-S03QCA-00: 插针结构:1x3P;间距:1mm;安装方式:卧贴;参考系列:SH;总PIN数:3P;排数:1;每排PIN数:3;行距:-;额定电流:500mA;工作温度范围:-25℃~+85℃;; LCSC Part Name: 1x3P 间距:1mm 卧贴 系列:SH; Supplier Part: C2764182; Manufacturer: JS(钜硕电子); Supplier Footprint: SMD,P=1mm,卧贴; JLCPCB Part Class: 扩展库; Datasheet: https://atta.szlcsc.com/upload/public/pdf/source/20210330/C2764181_391AED87194E28CE940989A69A8EDCC4.pdf; Supplier: LCSC; Pins Structure: 1x3P; Pitch: 1mm; Mounting Style: 卧贴; Reference Series: SH; Number of Pins: 3P; Number of Rows: 1; Number of PINs Per Row: 3; Current Rating (Max): 500mA; Operating Temperature Range: -25℃~+85℃

## Nets
+5V: C40.1 U24.1(Vout) X3.2
+6V: C61.2 U20.3(VIN)
+10V: C15.2 C18.2 C58.2 C59.2 D11.2(A) D12.2(A) D13.2(A) L1.1 R29.2 U1.4(VCC)
+12V: C41.2 Q1.5(D) Q1.6(D) Q1.7(D) Q1.8(D) Q1.9(D) Q3.5(D) Q3.6(D) Q3.7(D) Q3.8(D) Q3.9(D) Q5.5(D) Q5.6(D) Q5.7(D) Q5.8(D) Q5.9(D) R136.2 U19.2 U24.3(Vin)
GND: C4.2 C15.1 C18.1 C24.1 C25.1 C26.1 C27.2 C28.2 C29.1 C30.1 C31.1 C40.2 C41.1 C54.2 C55.2 C58.1 C59.1 C60.2 C61.1 C62.2 D14.2(+) H1.2 LED4.2(K) R25.1 R35.1 R65.1 R109.1 R114.1 R120.1 R123.1 R124.1 R125.1 R128.1 R131.1 R134.1 R137.1 R139.1 R140.1 SW2.1 U1.6(COM) U1.25(EP) U13.11(PA3) U13.13(PA5) U13.19(PB2) U13.49(EP) U18.7(GND) U20.1(ADJ(GND)) U21.2(GND) U21.8(RS) U24.2(GND) X2.2(GND) X3.1 X3.4 X3.5
VBUS: D7.2(+) R136.1 R137.2 U13.8(PA0)
VCC: C4.1 C25.2 C26.2 C27.1 C28.1 C30.2 C31.2 C62.1 D7.1(-) H1.1 R4.1 R127.2 R130.2 R133.2 U13.1(VBAT) U13.20(VREF+) U13.21(VDDA) U13.23(VDD) U13.35(VDD) U13.48(VDD) U20.2(VOUT(TAB)) U21.3(VCC)
CANH: R2.2 U21.7(CANH)
CANL: R2.1 U21.6(CANL)
CANRX: U13.33(PA11) U21.4(R)
CANTX: U13.47(PB9) U21.1(D)
HO1: R106.1 U1.19(HO1)
HO2: R117.1 U1.16(HO2)
HO3: R111.1 U1.13(HO3)
I2C1_SCL: U13.46(PB8-BOOT0)
I2C1_SDA: U13.45(PB7)
LO1: R107.1 U1.11(LO1)
LO2: R118.1 U1.10(LO2)
LO3: R112.1 U1.9(LO3)
OPA1+: R127.1 R128.2 R129.2 U13.9(PA1)
OPA2+: R130.1 R131.2 R132.2 U13.15(PA7)
OPA3+: R133.1 R134.2 R135.2 U13.16(PC4)
PWM: U13.38(PA15) X3.3
STATUS: R34.1 U13.25(PB12)
SWCLK: H1.4 R65.2 U13.37(PA14)
SWDIO: H1.3 R4.2 U13.36(PA13)
TIM1_CH1: U1.24(HIN3) U13.30(PA8)
TIM1_CH1N: U1.3(LIN3) U13.2(PC13)
TIM1_CH2: U1.23(HIN2) U13.31(PA9)
TIM1_CH2N: U1.2(LIN2) U13.34(PA12)
TIM1_CH3: U1.22(HIN1) U13.32(PA10)
TIM1_CH3N: U1.1(LIN1) U13.28(PB15)
USART2_RX: U13.42(PB4)
USART2_TX: U13.41(PB3)
VB1: C50.2 D13.1(K) U1.20(VB1)
VB2: C51.2 D12.1(K) U1.17(VB2)
VB3: C52.2 D11.1(K) U1.14(VB3)
VF1+: Q2.1(S) Q2.2(S) Q2.3(S) R123.2 R129.1
VF2+: Q6.1(S) Q6.2(S) Q6.3(S) R125.2 R132.1
VF3+: Q4.1(S) Q4.2(S) Q4.3(S) R124.2 R135.1
VS1: C22.2 C50.1 Q1.1(S) Q1.2(S) Q1.3(S) Q2.5(D) Q2.6(D) Q2.7(D) Q2.8(D) Q2.9(D) R108.1 U1.18(VS1)
VS2: C51.1 C63.2 Q5.1(S) Q5.2(S) Q5.3(S) Q6.5(D) Q6.6(D) Q6.7(D) Q6.8(D) Q6.9(D) R119.1 U1.15(VS2)
VS3: C52.1 C64.2 Q3.1(S) Q3.2(S) Q3.3(S) Q4.5(D) Q4.6(D) Q4.7(D) Q4.8(D) Q4.9(D) R113.1 U1.12(VS3)
$1N1629: Q1.4(G) R106.2 R108.2
$1N1634: Q2.4(G) R107.2 R109.2
$1N2404: Q3.4(G) R111.2 R113.2
$1N2407: Q4.4(G) R112.2 R114.2
$1N2845: Q5.4(G) R117.2 R119.2
$1N2848: Q6.4(G) R118.2 R120.2
$1N7882: R29.1 R35.2 U18.5(VSENSE)
$1N7884: C53.1 U18.1(BOOT)
$1N7885: C24.2 U18.4(SS)
$1N7887: C53.2 D14.1(-) L1.2 U18.8(PH)
$1N7888: C55.1 R138.2
$1N7890: C54.1 R138.1 U18.6(COMP)
$1N7895: C60.1 U18.2(VIN) U19.1
$1N10884: C22.1 R25.2
$1N10959: C63.1 R139.2
$1N11034: C64.1 R140.2
$2N3304: R33.1 X2.3(OSC2)
$2N3305: R33.2 U13.6(PF1-OSC_OUT)
$2N3309: C29.2 SW2.2 U13.7(PG10-NRST)
$2N3334: U13.5(PF0-OSC_IN) X2.1(OSC1)
$2N3382: LED4.1(A) R34.2

Not connected (* = marked no-connect by the designer): U1 5(NC)* 7(NC)* 8(NC)* 21(NC)*; U13 3(PC14-OSC32_IN)* 4(PC15-OSC32_OUT)* 10(PA2)* 12(PA4)* 14(PA6)* 17(PB0)* 18(PB1)* 22(PB10)* 24(PB11)* 26(PB13)* 27(PB14)* 29(PC6)* 39(PC10)* 40(PC11)* 43(PB5)* 44(PB6)*; U18 3(EN)*; U21 5(VREF)*
